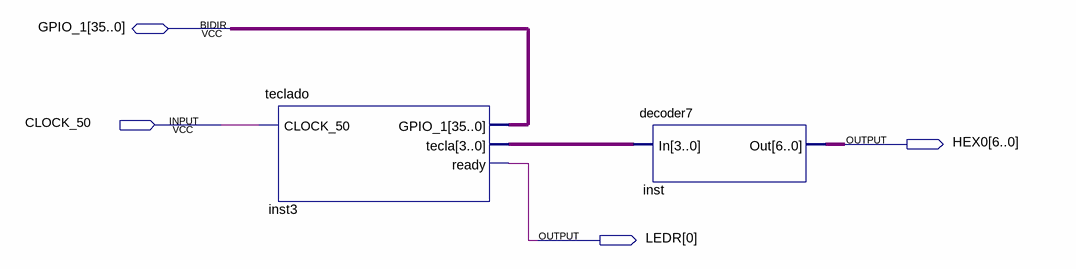
[diagram p0: schematic sheet]
// Quartus schematic top.bdf as structural Verilog: 2 symbols, 4 pins
module top (
  input  CLOCK_50,
  inout  [35:0] GPIO_1,
  output [6:0] HEX0,
  output [0:0] LEDR
);

  wire [3:0] inst3_tecla;

  teclado inst3 (.CLOCK_50(CLOCK_50), .tecla(inst3_tecla), .ready(LEDR[0]), .GPIO_1(GPIO_1));
  decoder7 inst (.In(inst3_tecla), .Out(HEX0));
endmodule
